# Altium schematic sheet SolidStateDosimeter.SchDoc
size 431 x 279 mm; SheetNumber: 6; SheetTotal: 8
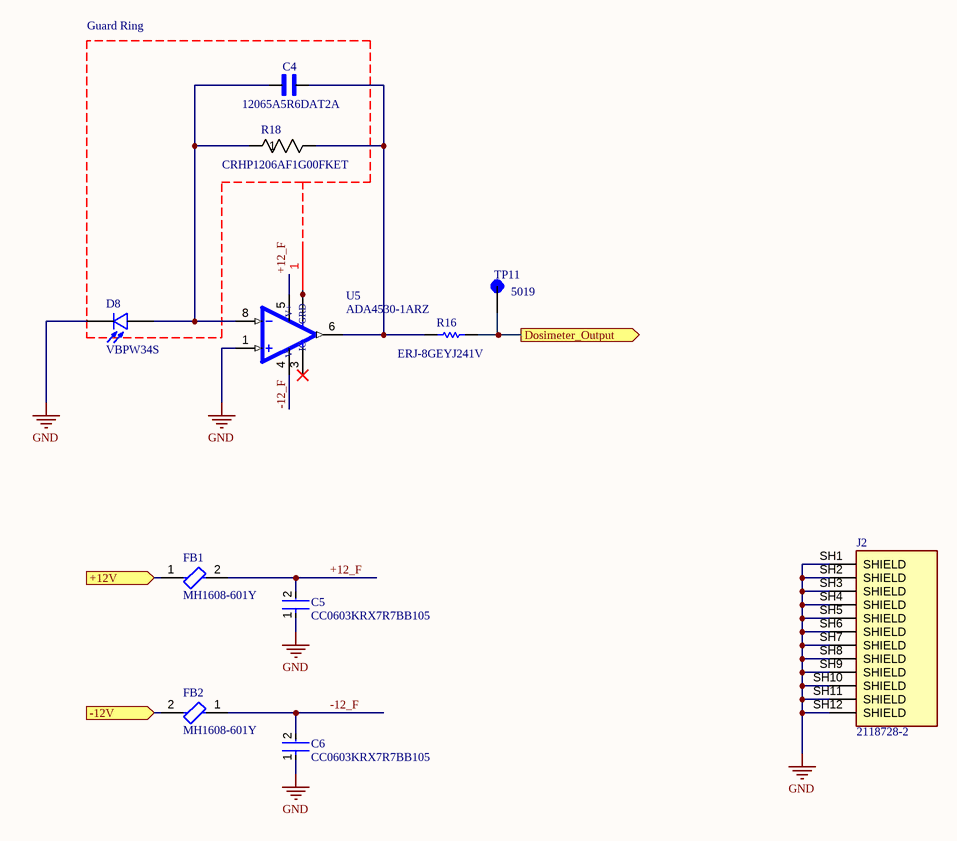
[diagram p0: SolidStateDosimeter.SchDoc]

## Parts
C4  12065A5R6DAT2A  [CAPC3216X94N]
C5  CC0603KRX7R7BB105  [FP-CC0603-DA-MFG]
C6  CC0603KRX7R7BB105  [FP-CC0603-DA-MFG]
D8  VBPW34S  [XDCR_VBPW34S]
FB1  MH1608-601Y  [FP-MH1608-MFG]
FB2  MH1608-601Y  [FP-MH1608-MFG]
GR  GUARD_RING  [Guard]  (value not drawn)
J2  2118728-2  [TE_2118728-2]
R16  ERJ-8GEYJ241V  [RESC3216X70X50NL05T20]
R18  CRHP1206AF1G00FKET  [RES_CRHP1206_VIS]
TP11  5019  [KEYSTONE_5019]
U5  ADA4530-1ARZ  [SOIC127P600X175-8N]

## Ports
+12V (in, see CoverSchematic[6C], Lownoise_auxReg[4D], Reference[9F], TemperatureMon[5D], TemperatureMon[6E], TemperatureMon[8D]), -12V (in, see CoverSchematic[6C], Lownoise_auxReg[4C], PassElement[4C], PassElement[4E], PassElement[4F], TemperatureMon[3D], TemperatureMon[3E], TemperatureMon[6D]), Dosimeter_Output (out, see CoverSchematic[5C])

## Nets
GND: C5.1 C6.1 D8.K(C) J2.SH1(SHIELD) J2.SH2(SHIELD) J2.SH3(SHIELD) J2.SH4(SHIELD) J2.SH5(SHIELD) J2.SH6(SHIELD) J2.SH7(SHIELD) J2.SH8(SHIELD) J2.SH9(SHIELD) J2.SH10(SHIELD) J2.SH11(SHIELD) J2.SH12(SHIELD) U5.1(+IN)
+12_F: C5.2 FB1.2 U5.5(V+)
+12V: FB1.1 ; port +12V
-12_F: C6.2 FB2.1 U5.4(V-)
-12V: FB2.2 ; port -12V
Dosimeter_Output: R16.2 TP11.TP ; port Dosimeter_Output
NetC4_1: C4.1 D8.A R18.1 U5.8(-IN)
NetC4_2: C4.2 R16.1 R18.2 U5.6(OUT)
NetGR_1: GR.1 U5.2(GRD) U5.7(GRD)

Not connected (* = marked no-connect by the designer): U5 3(IC)*

## Notes on the sheet
- DWG. NO.
- REV.
- SHT.
- THIS DOCUMENT AND THE DATA DISCLOSED HEREIN OR HEREWITH IS THE PROPERTY OF ALTIUM LIMITED AND MAY BE FREELY DISTRIBUTED IN WHOLE. NO RIGHTS ARE RESERVED OR EXPRESS OR IMPLIED WARANTEE GIVEN.
- REVISION
- DESCRIPTION
- DATE
- APPROVED
- TITLE
- PROJECT
- SCALE:
- B
- SIZE
- CAGE CODE
- FILE NAME
- DWG by:
- Heitor Sampaio Mendes
- SHEET
- OF
- REV
- (in symbol Component_1) Guard Ring

## Library data of the parts
C4 = 12065A5R6DAT2A: CAP CER 5.6PF 50V C0G/NP0 1206; MF: {'manufacturer': u'AVX'}; Package: None; Price: None; Value: *; MP: 12065A5R6DAT2A; Availability: Unavailable
C5 C6 = CMP-03422-000924-1: CAP CER 1UF 16V X7R 0603; Manufacturer: YAGEO; Tolerance: 0.1; Temperature Coefficient: 15%; Material: Ceramic; Package: CC0603-DA; RoHS: TRUE; Device Class L2: Capacitors; Temperature Characteristic: X7R; Temperature: -55°C to +125°C; Temperature Range Low: -55°C; Automotive: No; ComponentLink2Description: Datasheet; Value: 1 uF; Lead Free: Yes; Capacitance: 1 uF; ComponentLink2URL: http://www.yageo.com/documents/recent/UPY-GPHC_X7R_6.3V-to-50V_18.pdf; Device Class L1: Passive Components; Voltage: 16 V; Octopart: https://octopart.com/cc0603krx7r7bb105-yageo-42271928; Category: Cap; Digikey Description: CAP CER 1UF 16V X7R 0603; Footprint Url: http://www.yageo.com/exep/pages/download/literatures/UPY-C_GEN_24.pdf; Height: 0.9mm; Manufacturer Part Number: CC0603KRX7R7BB105; Voltage Rating: 16 V; Temperature Range High: +125°C; Mouser Description: Multilayer Ceramic Capacitor, CC Series, 1 - F, - 10%, X7R, 16 V, 0603 [1608 Metric]; Device Class L3: Ceramic Capacitors
D8 = VBPW34S: VBPW34SR Series 60 V 940 nm 50 mA 215 mW Surface Mount Silicon PIN Photodiode; MF: {'manufacturer': u'Vishay'}; Package: None; Price: None; Value: *; MP: VBPW34S; Availability: Unavailable
FB1 FB2 = CMP-2000-06698-2: FERRITE BEAD 600 OHM 0603 1LN; Tolerance: 25%; Max DC Current: 1A; Test Frequency: 100MHz; Current Rating: 3A; Number of Lines: 1; DC Resistance (DCR): 25mR; Impedance: 600R; Case/Package: 0603; Packaging: Tape and Reel; Case Code (Imperial): 0603; Radiation Hardening: No; Package Quantity: 1; Height: 0.039inch; Width: 0.031inch; Series: MH; REACH SVHC: No SVHC; Depth: 1mm; Min Operating Temperature: -55°C; Length: 0.063inch; Case Code (Metric): 1608; Termination: SMD/SMT; RoHS Compliant: Yes; DC Current: 1A; Max Current Rating: 1A; Core Material: Ferrite; Mount: Surface Mount; Military Standard: Not; Max Operating Temperature: 125°C
GR = Component_1
J2 = 2118728-2: MF: {'manufacturer': u'TE Connectivity'}; Package: None; Price: None; Value: *; MP: 2118728-2; Availability: Unavailable
R16 = CMP-2003-00592-1: Manufacturer: Panasonic; Part Number: ERJ-8GEYJ241V
R18 = CRHP1206AF1G00FKET: No Description Available; Mfr_Name: Vishay
TP11 = 5019: MF: {'manufacturer': u'Keystone Electronics'}; Package: None; Price: None; Value: *; MP: 5019; Availability: Unavailable
U5 = ADA4530-1ARZ: MF: {'manufacturer': u'Analog Devices'}; Package: None; Price: None; Value: *; MP: ADA4530-1ARZ; Availability: Unavailable